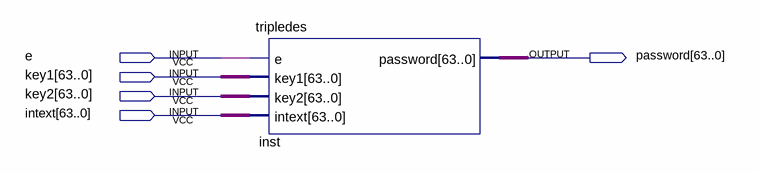
[diagram p0: schematic sheet]
// Quartus schematic topmoduleTripleDes.bdf as structural Verilog: 1 symbols, 5 pins
module topmoduleTripleDes (
  input  e,
  input  [63:0] key1,
  input  [63:0] key2,
  input  [63:0] intext,
  output [63:0] password
);

  tripledes inst (.e(e), .key1(key1), .key2(key2), .intext(intext), .password(password));
endmodule
